# EAGLE design BLDCDriver (EAGLE 7.7.0)
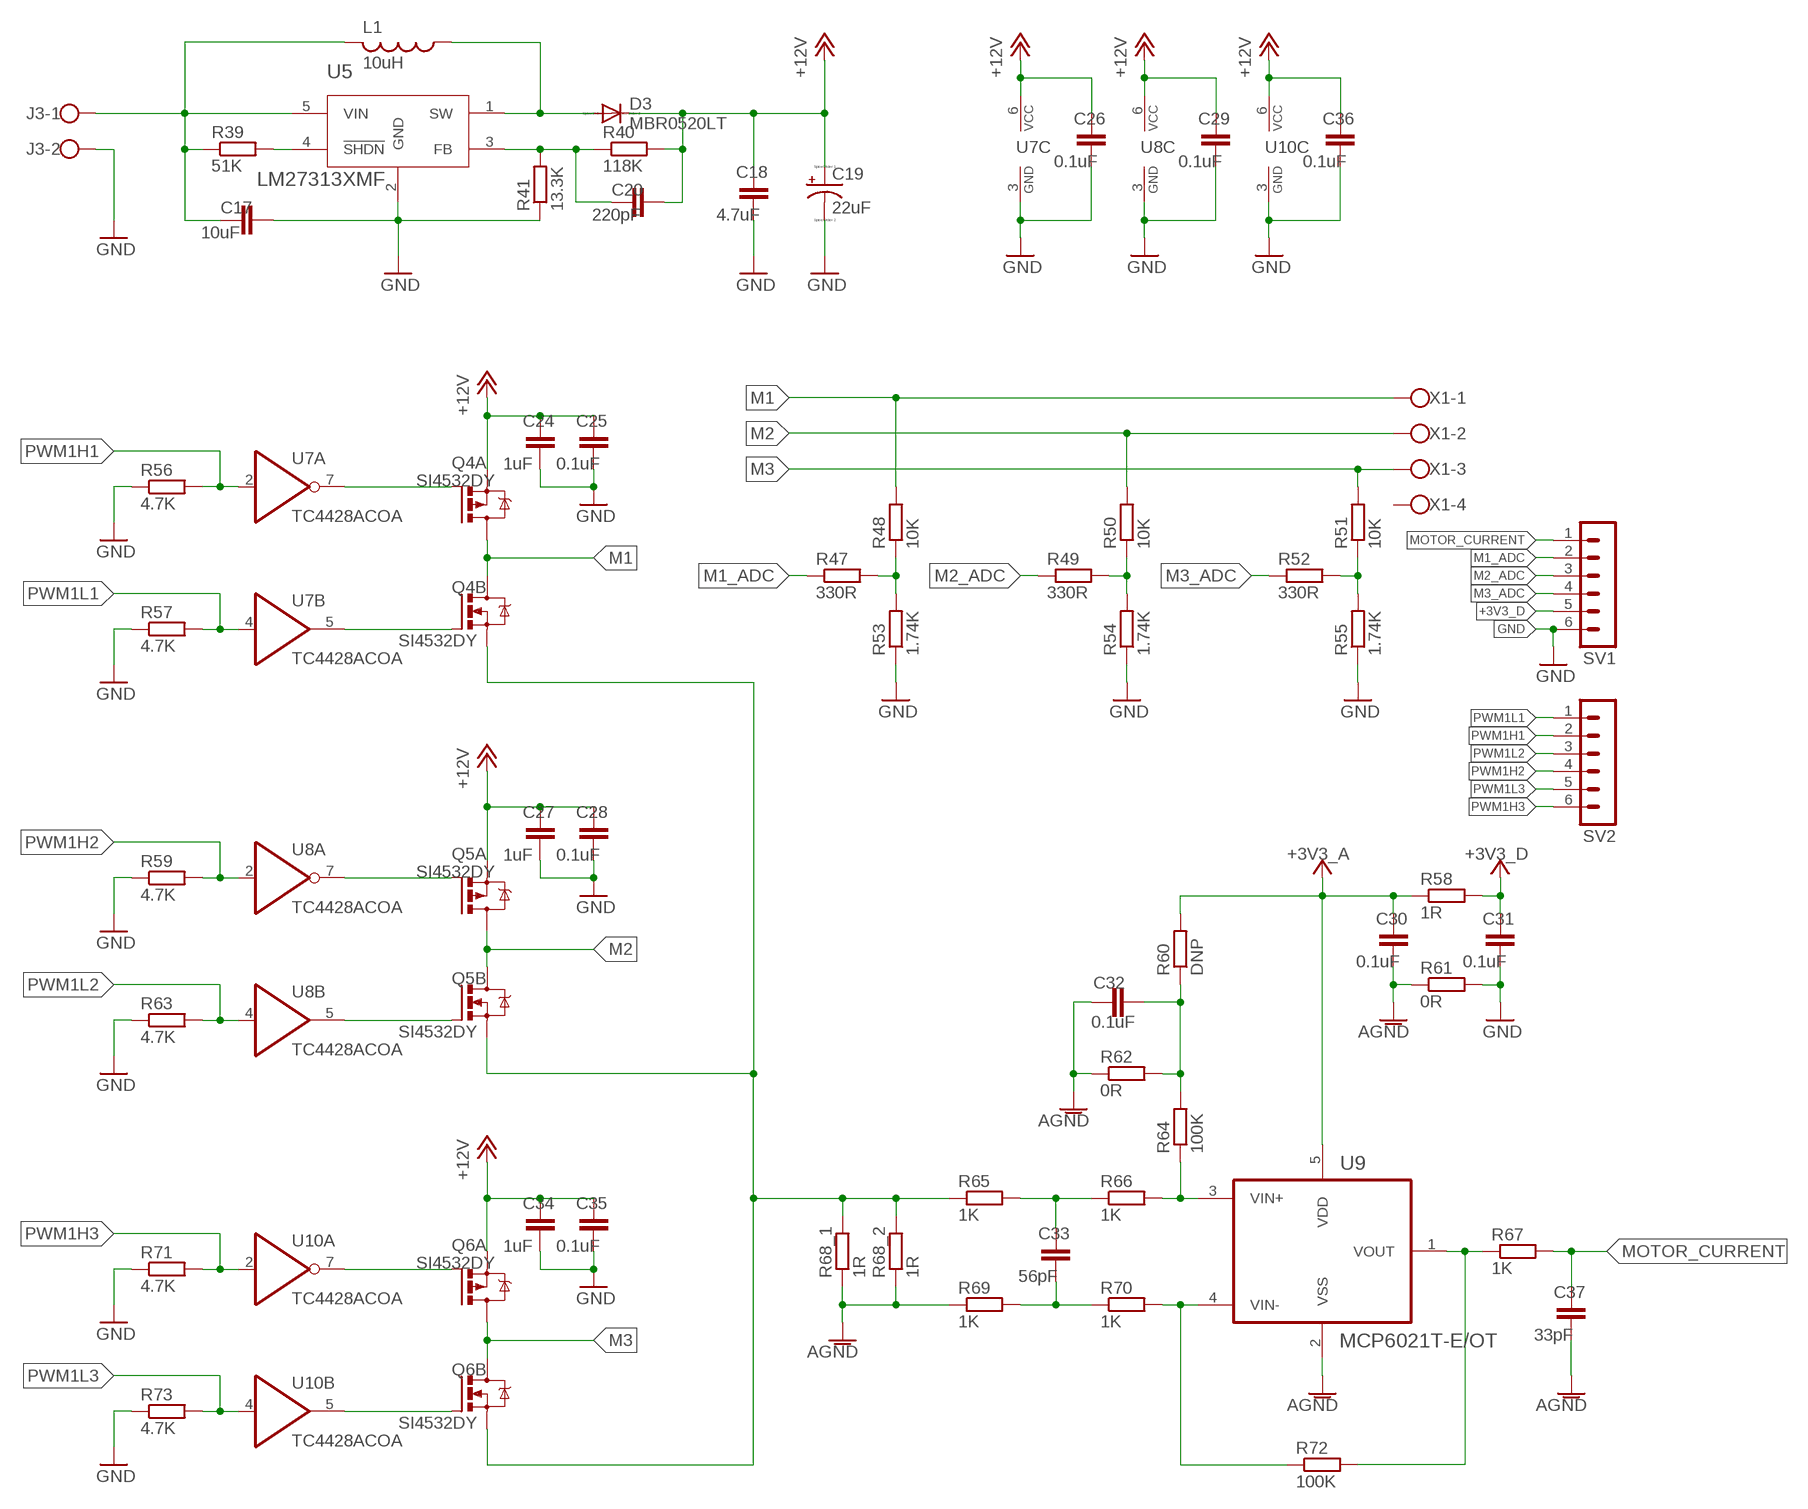
[diagram p0: schematic, sheet 1]

## Parts
C17  10uF  C-EUC0805  [C0805]
C18  4.7uF  C-EUC0805  [C0805]
C19  22uF  CPOL-USE2.5-6  [E2,5-6]
C20  220pF  C-EUC0805  [C0805]
C24  1uF  C-EUC0805  [C0805]
C25  0.1uF  C-EUC0805  [C0805]
C26  0.1uF  C-EUC0805  [C0805]
C27  1uF  C-EUC0805  [C0805]
C28  0.1uF  C-EUC0805  [C0805]
C29  0.1uF  C-EUC0805  [C0805]
C30  0.1uF  C-EUC0805  [C0805]
C31  0.1uF  C-EUC0805  [C0805]
C32  0.1uF  C-EUC0805  [C0805]
C33  56pF  C-EUC0805  [C0805]
C34  1uF  C-EUC0805  [C0805]
C35  0.1uF  C-EUC0805  [C0805]
C36  0.1uF  C-EUC0805  [C0805]
C37  33pF  C-EUC0805  [C0805]
D3  MBR0520LT  [SOD123]
J3  W237-102  [W237-102]
L1  10uH  L-USL3225M  [L3225M]
Q4  SI4532DY  [SOIC127P600X175-8N]
Q5  SI4532DY  [SOIC127P600X175-8N]
Q6  SI4532DY  [SOIC127P600X175-8N]
R39  51K  R-EU_R0805  [R0805]
R40  118K  R-EU_R0805  [R0805]
R41  13.3K  R-EU_R0805  [R0805]
R47  330R  R-EU_R0805  [R0805]
R48  10K  R-EU_R0805  [R0805]
R49  330R  R-EU_R0805  [R0805]
R50  10K  R-EU_R0805  [R0805]
R51  10K  R-EU_R0805  [R0805]
R52  330R  R-EU_R0805  [R0805]
R53  1.74K  R-EU_R0805  [R0805]
R54  1.74K  R-EU_R0805  [R0805]
R55  1.74K  R-EU_R0805  [R0805]
R56  4.7K  R-EU_R0805  [R0805]
R57  4.7K  R-EU_R0805  [R0805]
R58  1R  R-EU_R0805  [R0805]
R59  4.7K  R-EU_R0805  [R0805]
R60  DNP  R-EU_R0805  [R0805]
R61  0R  R-EU_R0805  [R0805]
R62  0R  R-EU_R0805  [R0805]
R63  4.7K  R-EU_R0805  [R0805]
R64  100K  R-EU_R0805  [R0805]
R65  1K  R-EU_R0805  [R0805]
R66  1K  R-EU_R0805  [R0805]
R67  1K  R-EU_R0805  [R0805]
R68_1  1R  R-EU_R0805  [R0805]
R68_2  1R  R-EU_R0805  [R0805]
R69  1K  R-EU_R0805  [R0805]
R70  1K  R-EU_R0805  [R0805]
R71  4.7K  R-EU_R0805  [R0805]
R72  100K  R-EU_R0805  [R0805]
R73  4.7K  R-EU_R0805  [R0805]
SV1  MA06-1  [MA06-1]
SV2  MA06-1  [MA06-1]
U5  LM27313XMF  [SOT95P285X120-5N]
U7  TC4428ACOA  [SOIC127P600X175-8N]
U8  TC4428ACOA  [SOIC127P600X175-8N]
U9  MCP6021T-E/OT  [SOT95P320X145-5N]
U10  TC4428ACOA  [SOIC127P600X175-8N]
X1  W237-4  [W237-4]

## Nets
+3V3_A: C30.1 R58.1 R60.2 U9.5(VDD) ; supply symbol labelled +3V3
+3V3_D: C31.1 R58.2 SV1.5 ; supply symbol labelled +3V3
+12V [+12V]: C18.1 C19.+ C20.2 C24.2 C25.2 C26.1 C27.2 C28.2 C29.1 C34.2 C35.2 C36.1 D3.C Q4.1(A:S) Q5.1(A:S) Q6.1(A:S) R40.2 U7.6(C:VCC) U8.6(C:VCC) U10.6(C:VCC)
AGND [agnd]: C30.2 C32.1 C37.2 R61.1 R62.1 R68_1.1 R68_2.1 R69.1 U9.2(VSS)
GND [gnd]: C17.2 C18.2 C19.- C24.1 C25.1 C26.2 C27.1 C28.1 C29.2 C31.2 C34.1 C35.1 C36.2 J3.2 R41.1 R53.1 R54.1 R55.1 R56.1 R57.1 R59.1 R61.2 R63.1 R71.1 R73.1 SV1.6 U5.2(GND) U7.3(C:GND) U8.3(C:GND) U10.3(C:GND)
M1 [motor]: Q4.5(B:D) Q4.7(A:D) R48.2 X1.1
M1_ADC: R47.1 SV1.2
M2 [motor]: Q5.5(B:D) Q5.7(A:D) R50.2 X1.2
M2_ADC: R49.1 SV1.3
M3 [motor]: Q6.5(B:D) Q6.7(A:D) R51.2 X1.3
M3_ADC: R52.1 SV1.4
MOTOR_CURRENT: C37.1 R67.2 SV1.1
N$1 [VccIn]: C17.1 J3.1 L1.2 R39.1 U5.5(VIN)
N$2: R39.2 U5.4(!SHDN!)
N$3: Q6.4(B:G) U10.5(B:O)
N$4: C20.1 R40.1 R41.2 U5.3(FB)
N$5: D3.A L1.1 U5.1(SW)
N$6: Q6.2(A:G) U10.7(A:O)
N$7: Q5.4(B:G) U8.5(B:O)
N$8: Q5.2(A:G) U8.7(A:O)
N$9: Q4.4(B:G) U7.5(B:O)
N$10: Q4.2(A:G) U7.7(A:O)
N$11: C33.2 R65.2 R66.1
N$12: C33.1 R69.2 R70.1
N$13: R64.1 R66.2 U9.3(VIN+)
N$14: Q4.3(B:S) Q5.3(B:S) Q6.3(B:S) R65.1 R68_1.2 R68_2.2
N$15: R70.2 R72.1 U9.4(VIN-)
N$16: R67.1 R72.2 U9.1(VOUT)
N$17: C32.2 R60.1 R62.2 R64.2
N$21: R51.1 R52.2 R55.2
N$22: R49.2 R50.1 R54.2
N$23: R47.2 R48.1 R53.2
PWM1H1: R56.2 SV2.2 U7.2(A:I)
PWM1H2: R59.2 SV2.4 U8.2(A:I)
PWM1H3: R71.2 SV2.6 U10.2(A:I)
PWM1L1: R57.2 SV2.1 U7.4(B:I)
PWM1L2: R63.2 SV2.3 U8.4(B:I)
PWM1L3: R73.2 SV2.5 U10.4(B:I)
Unconnected: X1.4

## Library data of the parts
C17 C18 C20 C24-C37 = resistor:C-EU: CAPACITOR, European symbol
C19 = resistor:CPOL-US: POLARIZED CAPACITOR, American symbol
D3 = diode:MBR0520LT: SCHOTTKY BARRIER RECTIFIER Source: http://onsemi.com .. MBR0520LT1-D.pdf
J3 = con-wago-500:W237-102: WAGO SCREW CLAMP; MPN: 237-102; OC_FARNELL: unknown; OC_NEWARK: 70K9898
L1 = resistor:L-US: INDUCTOR, American symbol
Q4-Q6 = SI4532DY:SI4532DY
R39-R41 R47-R67 R68_1 R68_2 R69-R73 = resistor:R-EU_: RESISTOR, European symbol
SV1 SV2 = con-lstb:MA06-1: PIN HEADER; OC_FARNELL: unknown; OC_NEWARK: unknown
U5 = LM27313XMF:LM27313XMF: BOOST CONVERTER; MPN: LM27313XMF; OC_FARNELL: 1564771; OC_NEWARK: 32M1010; PACKAGE: SOT-23-5; SUPPLIER: NationalSemiconductor
U7 U8 U10 = TC4428AEOA:TC4428ACOA: DRIVER, MOSFET, DUAL 1.5A; MPN: TC4428ACOA; OC_FARNELL: 1332312; OC_NEWARK: 34M8781; PACKAGE: SOIC-8; SUPPLIER: Microchip
U9 = MCP6021T:MCP6021T-E/OT: IC OPAMP 2.5V R-R I/O; MPN: MCP6021T-E/OT; OC_FARNELL: 1605573; OC_NEWARK: 84R5185; PACKAGE: SOT23-5; SUPPLIER: Microchip
X1 = con-wago-500:W237-4: WAGO SCREW CLAMP; OC_FARNELL: unknown; OC_NEWARK: unknown

## Net classes
0 default: drill 0.61 mm, clearance 0.205 mm
1 VccIn: width 0.61 mm, drill 0.61 mm, clearance 0.305 mm to class 0, clearance 0.305 mm
2 gnd: width 0.508 mm, drill 0.61 mm, clearance 0.305 mm to class 0, clearance 0.305 mm to class 1, clearance 0.305 mm
3 +12V: width 0.61 mm, drill 0.61 mm, clearance 0.305 mm to class 0, clearance 0.305 mm to class 1, clearance 0.305 mm to class 2, clearance 0.305 mm
4 agnd: width 0.508 mm, drill 0.61 mm, clearance 0.305 mm to class 0, clearance 0.305 mm to class 1, clearance 0.305 mm to class 2, clearance 0.305 mm to class 3, clearance 0.305 mm
5 motor: width 0.61 mm, drill 0.61 mm, clearance 0.305 mm to class 0, clearance 0.305 mm to class 1, clearance 0.305 mm to class 2, clearance 0.305 mm to class 3, clearance 0.305 mm to class 4, clearance 0.305 mm

## Board
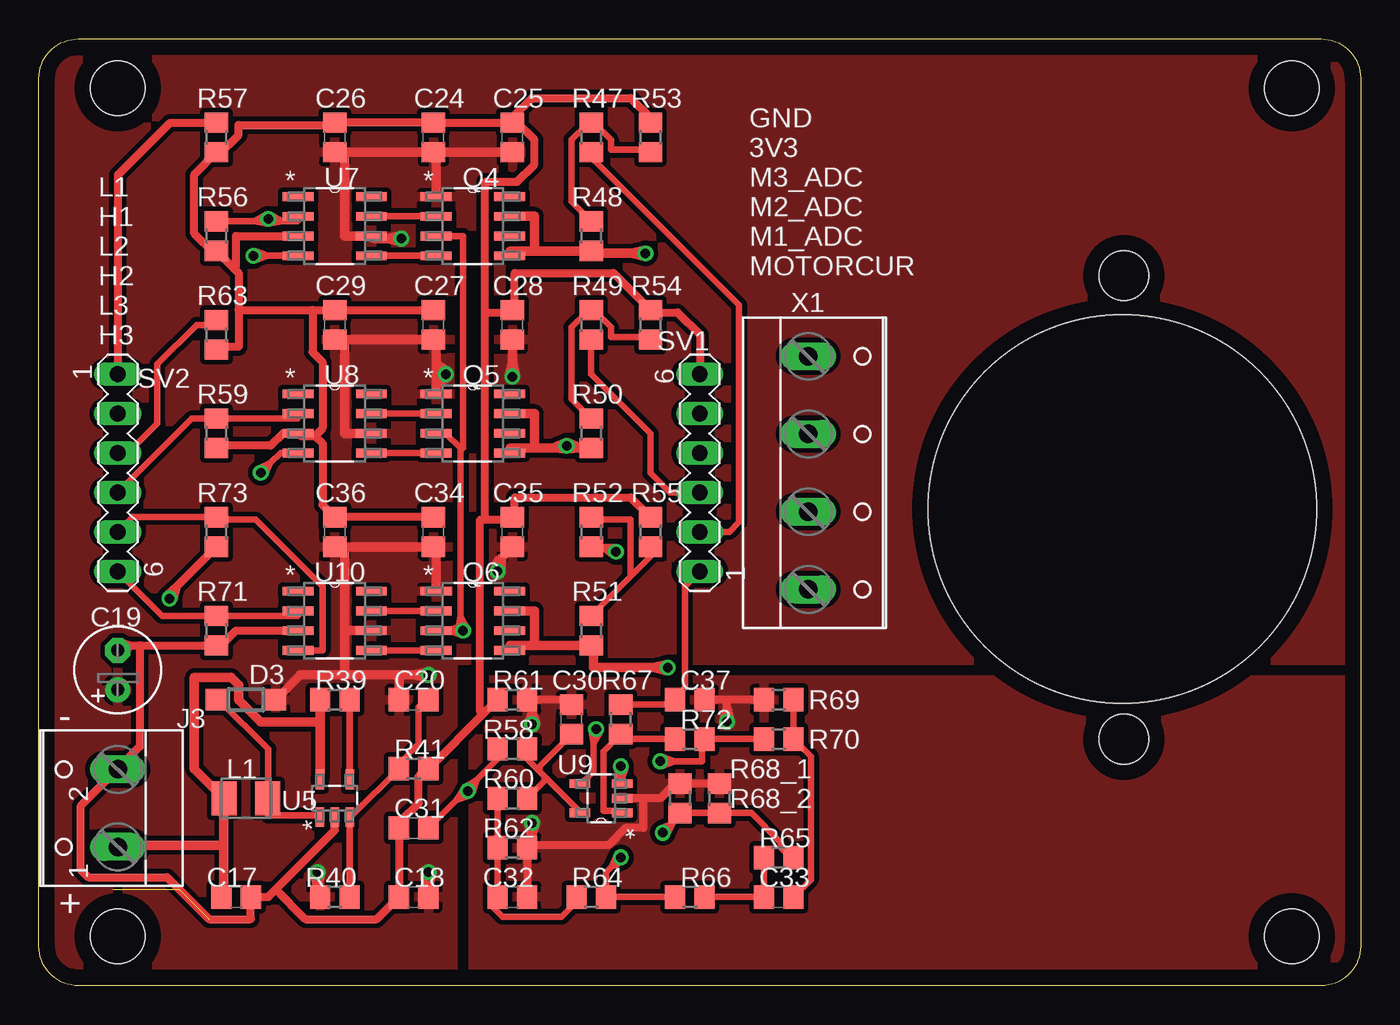
[diagram p1: board, top side]
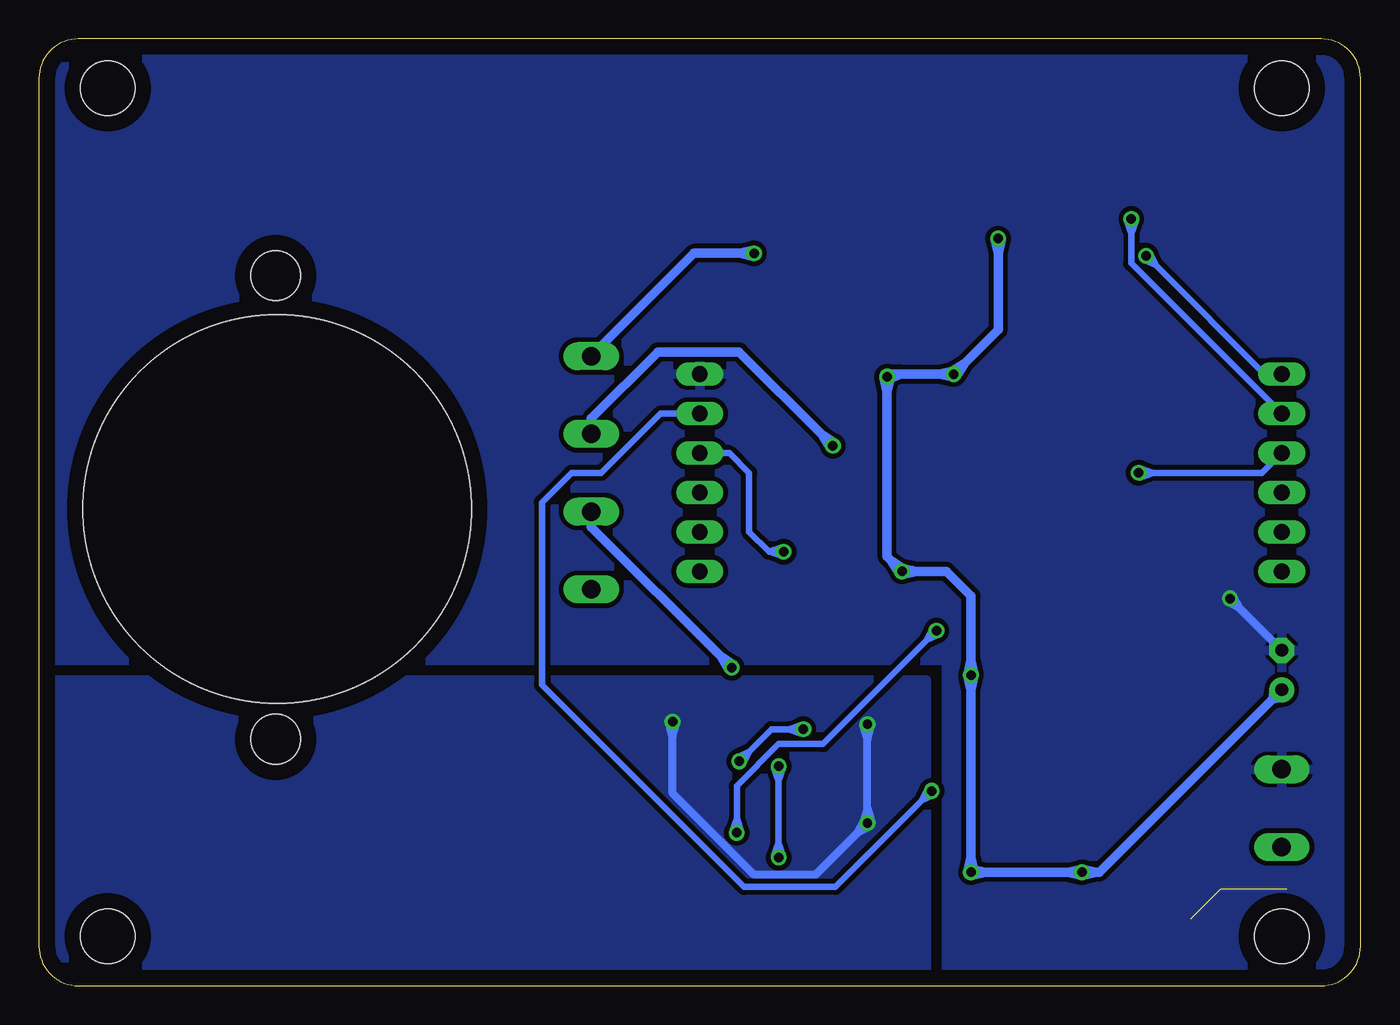
[diagram p2: board, bottom side, seen from below]

Size 85.09 x 60.96 mm. Coordinates in mm from the lower left corner, seen from the top.
Outline: 0,2.54 0,58.42 arc-90 2.54,60.96 82.55,60.96 arc-90 85.09,58.42 85.09,2.54 arc-90 82.55,0 2.54,0 arc-90 0,2.54
Copper layers (1*16): Top 0.035mm / dielectric 1.5mm / Bottom 0.035mm
Design rules "BLDCDriver": minimum track width 16mil, minimum drill 24mil, track to track 0.205mm, track to pad 0.205mm, pad to pad 0.205mm, via to via 0.205mm, smd to smd 8mil, copper to edge 40mil, drill to drill 8mil, minimum pad ring 10mil, minimum via ring 8mil, stop-mask expansion 4mil, vias tented up to drill 24mil, thermal gap 10mil
Holes 3.2 mm at 69.85,45.72 69.85,15.88
Holes 25 mm at 69.74,30.7
Holes 3.5 mm at 80.64,57.78 5.08,57.78 5.08,3.17 80.64,3.17

### Footprints (pad centres in the part's own frame; a part is rotated, then mirrored left to right if it is on the bottom)
C0805 = smd 1.3 x 1.5: 1 -0.95,0; 2 0.95,0
E2,5-6 = drill 0.813 pad 1.6: + -1.27,0 | drill 0.813 pad 1.6 octagon: - 1.27,0
SOD123 = smd 1.4 x 1.4: A 1.9,0; C -1.9,0
W237-102 = drill 1.194 long: 1 -2.5,-1.27; 2 2.5,-1.27
L3225M = smd 1.6 x 2.2: 1 -1.4,0; 2 1.4,0
SOIC127P600X175-8N = smd 1.981 x 0.559: 1 -2.362,1.905; 2 -2.362,0.635; 3 -2.362,-0.635; 4 -2.362,-1.905; 5 2.362,-1.905; 6 2.362,-0.635; 7 2.362,0.635; 8 2.362,1.905
R0805 = smd 1.3 x 1.5: 1 -0.95,0; 2 0.95,0
MA06-1 = drill 1.016 long: 1 -6.35,0; 2 -3.81,0; 3 -1.27,0; 4 1.27,0; 5 3.81,0; 6 6.35,0
SOT95P285X120-5N = smd 1.27 x 0.559: 1 -1.219,0.965; 2 -1.219,0; 3 -1.219,-0.965; 4 1.219,-0.965; 5 1.219,0.965
SOT95P320X145-5N = smd 1.321 x 0.559: 1 -1.372,0.94; 2 -1.372,0; 3 -1.372,-0.94; 4 1.372,-0.94; 5 1.372,0.94
W237-4 = drill 1.194 long: 1 -7.5,-1.27; 2 -2.5,-1.27; 3 2.5,-1.27; 4 7.5,-1.27

### Placement (x,y rotation side)
C17  12.7,5.71 0 top
C18  24.13,5.71 180 top
C19  5.08,20.32 90 top
C20  24.13,18.41 180 top
C24  25.4,54.61 270 top
C25  30.48,54.61 270 top
C26  19.05,54.61 90 top
C27  25.4,42.55 270 top
C28  30.48,42.55 270 top
C29  19.05,42.55 90 top
C30  34.29,17.14 90 top
C31  24.13,10.16 180 top
C32  30.48,5.71 180 top
C33  47.62,5.71 180 top
C34  25.4,29.21 270 top
C35  30.48,29.21 270 top
C36  19.05,29.21 90 top
C37  41.91,18.41 0 top
D3  13.34,18.41 180 top
J3  3.81,11.43 90 top
L1  13.34,12.06 180 top
Q4  27.94,48.9 0 top
Q5  27.94,36.2 0 top
Q6  27.94,23.5 0 top
R39  19.05,18.41 0 top
R40  19.05,5.71 180 top
R41  24.13,13.97 180 top
R47  35.56,54.61 90 top
R48  35.56,48.26 270 top
R49  35.56,42.55 90 top
R50  35.56,35.56 270 top
R51  35.56,22.86 270 top
R52  35.56,29.21 90 top
R53  39.37,54.61 270 top
R54  39.37,42.55 270 top
R55  39.37,29.21 270 top
R56  11.43,48.26 90 top
R57  11.43,54.61 90 top
R58  30.48,15.24 180 top
R59  11.43,35.56 90 top
R60  30.48,12.06 0 top
R61  30.48,18.41 180 top
R62  30.48,8.89 180 top
R63  11.43,41.91 90 top
R64  35.56,5.71 180 top
R65  47.62,8.26 180 top
R66  41.91,5.71 180 top
R67  37.47,17.14 90 top
R68_1  41.27,12.06 270 top
R68_2  43.81,12.06 270 top
R69  47.62,18.41 0 top
R70  47.62,15.88 180 top
R71  11.43,22.86 90 top
R72  41.91,15.88 180 top
R73  11.43,29.21 90 top
SV1  42.55,33.02 90 top
SV2  5.08,33.02 270 top
U5  19.05,12.06 90 top
U7  19.05,48.9 0 top
U8  19.05,36.2 0 top
U9  36.2,12.06 180 top
U10  19.05,23.5 0 top
X1  50.8,33.02 270 top

### Tracks (layer width: path | path; a pad name or v marks a point on that pad's centre or on a via)
+3V3_A
  Top 0.406: 32.15,13.89 31.43,14.61 R58.1 | 32.15,13.89 32.62,13.41 | 32.62,13.41 34.77,11.27 U9.5 | R60.2 32.54,13.18 32.54,13.34 32.62,13.41 | C30.1 32.23,14.13 32.23,13.97 32.15,13.89
+3V3_D  (via drill 0.61)
  Top 0.406: 28.18,13.26 29.53,14.61 R58.2 | 28.18,13.26 27.54,12.62 | 27.54,12.62 26.9,11.98 | 26.9,11.98 C31.1 | v27.62,12.54 27.54,12.62 | 28.18,13.26 | 28.18,13.26 27.46,12.8 | v27.62,12.54 27.46,12.8 | 28.18,13.26 27.91,12.45 | v27.62,12.54 27.91,12.45 | 26.9,11.98 | 26.9,11.98 27.72,12.25 | v27.62,12.54 27.72,12.25 | 26.9,11.98 27.37,12.71 | v27.62,12.54 27.37,12.71 | 28.18,13.26 27.46,12.8 | v27.62,12.54 27.46,12.8 | 28.18,13.26 27.46,12.8 | v27.62,12.54 27.46,12.8 | 28.18,13.26 27.91,12.45 | v27.62,12.54 27.91,12.45 | 26.9,11.98 27.72,12.25 | 26.9,11.98 27.37,12.71 | v27.62,12.54 27.37,12.71 | 26.9,11.98 27.72,12.25 | v27.62,12.54 27.72,12.25 | 26.9,11.98 27.37,12.71 | v27.62,12.54 27.37,12.71
  Bottom 0.406: v27.62,12.54 28.27,11.89 | 28.27,11.89 33.81,6.35 39.69,6.35 52.7,19.37 52.7,31.11 50.8,33.02 48.9,33.02 45.09,36.83 SV1.5 | 28.27,11.89 27.9,12.67 | v27.62,12.54 27.9,12.67 | 28.27,11.89 27.49,12.27 | v27.62,12.54 27.49,12.27 | 28.27,11.89 27.9,12.67 | 28.27,11.89 27.49,12.27 | 28.27,11.89 27.9,12.67 | v27.62,12.54 27.9,12.67 | 28.27,11.89 27.49,12.27 | v27.62,12.54 27.49,12.27
+12V  (via drill 0.61)
  Top 0.61: Q6.1 25.56,25.4 25.56,28.1 C34.2 C36.1 19.68,28.1 19.68,22.86 | 23.18,20 19.68,20 | 19.68,20 16.83,20 D3.C | 23.18,20 C20.2 | 19.68,22.86 U10.6 | 19.68,20 19.68,22.86 | C24.2 C26.1 19.68,53.5 19.68,48.26 U7.6 21.59,48.1 22.42,48.1 | C25.2 25.56,53.66 C24.2 | Q4.1 25.56,50.8 25.56,53.5 C24.2 | U8.6 19.68,35.56 19.68,41.43 C29.1 C27.2 25.56,41.43 25.56,40.03 | 25.56,40.03 25.56,39.37 | 25.56,39.37 25.56,38.71 | 25.56,38.71 25.56,38.1 Q5.1 | v17.94,7.3 17.94,6.39 | 17.94,6.39 17.94,5.87 R40.2 | C18.1 24.92,5.71 25.08,5.87 25.08,6.39 | 29.77,27.55 29.53,27.3 v29.53,26.67 | 29.77,27.55 C35.2 | v30.48,39.21 30.48,40.13 | 30.48,40.13 C28.2 | v26.19,39.37 25.56,39.37 | v23.34,48.1 22.42,48.1 | v25.08,20 24.17,20 | 24.17,20 23.18,20 | 25.08,6.39 v25.08,7.3 | 17.94,6.39 18.14,7.26 | v17.94,7.3 18.14,7.26 | 17.94,6.39 17.74,7.26 | v17.94,7.3 17.74,7.26 | 17.94,6.39 18.14,7.26 | 17.94,6.39 17.74,7.26 | 17.94,6.39 18.14,7.26 | v17.94,7.3 18.14,7.26 | 17.94,6.39 17.74,7.26 | v17.94,7.3 17.74,7.26 | 25.08,6.39 25.28,7.26 | v25.08,7.3 25.28,7.26 | 25.08,6.39 24.88,7.26 | v25.08,7.3 24.88,7.26 | 25.08,6.39 25.28,7.26 | 25.08,6.39 24.88,7.26 | 25.08,6.39 25.28,7.26 | v25.08,7.3 25.28,7.26 | 25.08,6.39 24.88,7.26 | v25.08,7.3 24.88,7.26 | 29.77,27.55 29.35,26.77 v29.53,26.67 | 29.77,27.55 29.73,26.66 v29.53,26.67 | 30.48,40.13 30.28,39.26 | v30.48,39.21 30.28,39.26 | 30.48,40.13 30.68,39.26 | v30.48,39.21 30.68,39.26 | 30.48,40.13 30.28,39.26 | 30.48,40.13 30.68,39.26 | 30.48,40.13 30.28,39.26 | v30.48,39.21 30.28,39.26 | 30.48,40.13 30.68,39.26 | v30.48,39.21 30.68,39.26 | 25.56,40.03 26.02,39.27 v26.19,39.37 | 25.56,40.03 26.3,39.54 v26.19,39.37 | 25.56,38.71 26.3,39.2 v26.19,39.37
  Top 0.61: 25.56,38.71 26.02,39.48 v26.19,39.37 | 22.42,48.1 23.29,47.9 | v23.34,48.1 23.29,47.9 | 22.42,48.1 23.29,48.3 | v23.34,48.1 23.29,48.3 | 22.42,48.1 23.29,47.9 | 22.42,48.1 23.29,48.3 | 22.42,48.1 23.29,47.9 | v23.34,48.1 23.29,47.9 | 22.42,48.1 23.29,48.3 | v23.34,48.1 23.29,48.3 | 24.17,20 25.04,19.8 | v25.08,20 25.04,19.8 | 24.17,20 25.04,20.2 | v25.08,20 25.04,20.2 | 25.04,19.8 24.17,20 25.04,20.2 | 24.17,20 25.04,19.8 | v25.08,20 25.04,19.8 | 24.17,20 25.04,20.2 | v25.08,20 25.04,20.2
  Bottom 0.61: 17.02,7.3 16.83,7.3 5.66,18.48 | 17.02,7.3 v17.94,7.3 | C19.+ 5.66,18.48 | v17.94,7.3 18.85,7.3 | 18.85,7.3 24.17,7.3 | 24.17,7.3 v25.08,7.3 | v25.08,7.3 25.24,7.46 25.08,7.62 25.08,8.22 | 30.48,38.3 30.48,27.62 30.17,27.32 | 30.48,38.3 v30.48,39.21 | v29.53,26.67 30.17,27.32 | 29.58,39.37 30.32,39.37 v30.48,39.21 | 29.58,39.37 27.11,39.37 | 27.11,39.37 v26.19,39.37 | 23.34,47.19 23.34,42.23 25.55,40.02 | 23.34,47.19 v23.34,48.1 | v26.19,39.37 25.55,40.02 | 25.08,8.22 25.08,19.09 | 25.08,19.09 v25.08,20 | v25.08,20 25.08,20.92 | 25.08,20.92 25.08,25.08 26.67,26.67 28.61,26.67 | 28.61,26.67 v29.53,26.67 | 17.02,7.3 17.89,7.1 | v17.94,7.3 17.89,7.1 | 17.02,7.3 17.89,7.5 | v17.94,7.3 17.89,7.5 | 18.85,7.3 17.98,7.5 | v17.94,7.3 17.98,7.5 | 18.85,7.3 17.98,7.1 | v17.94,7.3 17.98,7.1 | 17.89,7.1 17.02,7.3 17.89,7.5 | 17.02,7.3 17.89,7.1 | v17.94,7.3 17.89,7.1 | 17.02,7.3 17.89,7.5 | v17.94,7.3 17.89,7.5 | 18.85,7.3 17.98,7.5 | 18.85,7.3 17.98,7.1 | 17.98,7.5 18.85,7.3 17.98,7.1 | v17.94,7.3 17.98,7.5 | v17.94,7.3 17.98,7.1 | 24.17,7.3 25.04,7.1 | v25.08,7.3 25.04,7.1 | 24.17,7.3 25.04,7.5 | v25.08,7.3 25.04,7.5 | 25.08,8.22 24.88,7.35 | v25.08,7.3 24.88,7.35 | 25.08,8.22 25.28,7.35 | v25.08,7.3 25.28,7.35 | 25.04,7.1 24.17,7.3 25.04,7.5 | 24.17,7.3 25.04,7.1 | v25.08,7.3 25.04,7.1 | 24.17,7.3 25.04,7.5 | v25.08,7.3 25.04,7.5 | 25.08,8.22 24.88,7.35 | 25.08,8.22 25.28,7.35 | 25.08,8.22 24.88,7.35 | v25.08,7.3 24.88,7.35 | 25.08,8.22 25.28,7.35 | v25.08,7.3 25.28,7.35 | 30.17,27.32 29.42,26.84 | v29.53,26.67 29.42,26.84 | 30.17,27.32 29.7,26.56 | v29.53,26.67 29.7,26.56 | 28.61,26.67 29.48,26.47 | v29.53,26.67 29.48,26.47 | 28.61,26.67 29.48,26.87 | v29.53,26.67 29.48,26.87 | 30.17,27.32 29.42,26.84
  Bottom 0.61: v29.53,26.67 29.42,26.84 | 30.17,27.32 29.7,26.56 | v29.53,26.67 29.7,26.56 | 28.61,26.67 29.48,26.47 | 28.61,26.67 29.48,26.87 | 28.61,26.67 29.48,26.47 | v29.53,26.67 29.48,26.47 | 28.61,26.67 29.48,26.87 | v29.53,26.67 29.48,26.87 | 30.48,38.3 30.68,39.17 | v30.48,39.21 30.68,39.17 | 30.48,38.3 30.28,39.17 | v30.48,39.21 30.28,39.17 | 30.48,38.3 30.68,39.17 | 30.48,38.3 30.28,39.17 | 30.48,38.3 30.68,39.17 | v30.48,39.21 30.68,39.17 | 30.48,38.3 30.28,39.17 | v30.48,39.21 30.28,39.17 | 29.58,39.37 30.4,39.02 v30.48,39.21 | 29.58,39.37 30.47,39.41 v30.48,39.21 | 27.11,39.37 26.24,39.57 | v26.19,39.37 26.24,39.57 | 27.11,39.37 26.24,39.17 | v26.19,39.37 26.24,39.17 | 25.55,40.02 26.02,39.26 | v26.19,39.37 26.02,39.26 | 25.55,40.02 26.3,39.54 | v26.19,39.37 26.3,39.54 | 27.11,39.37 26.24,39.57 | 27.11,39.37 26.24,39.17 | 27.11,39.37 26.24,39.57 | v26.19,39.37 26.24,39.57 | 27.11,39.37 26.24,39.17 | v26.19,39.37 26.24,39.17 | 25.55,40.02 26.02,39.26 | 25.55,40.02 26.3,39.54 | 25.55,40.02 26.02,39.26 | v26.19,39.37 26.02,39.26 | 25.55,40.02 26.3,39.54 | v26.19,39.37 26.3,39.54 | 23.34,47.19 23.53,48.06 | v23.34,48.1 23.53,48.06 | 23.34,47.19 23.14,48.06 | v23.34,48.1 23.14,48.06 | 23.34,47.19 23.53,48.06 | 23.34,47.19 23.14,48.06 | 23.34,47.19 23.53,48.06 | v23.34,48.1 23.53,48.06 | 23.34,47.19 23.14,48.06 | v23.34,48.1 23.14,48.06 | 25.08,19.09 25.28,19.96 | v25.08,20 25.28,19.96 | 25.08,19.09 24.88,19.96 | v25.08,20 24.88,19.96 | 25.08,20.92 24.88,20.05 | v25.08,20 24.88,20.05 | 25.08,20.92 25.28,20.05 | v25.08,20 25.28,20.05 | 25.08,19.09 25.28,19.96 | 25.08,19.09 24.88,19.96 | 25.08,19.09 25.28,19.96 | v25.08,20 25.28,19.96 | 25.08,19.09 24.88,19.96 | v25.08,20 24.88,19.96
  Bottom 0.61: 25.08,20.92 24.88,20.05 | 25.08,20.92 25.28,20.05 | 25.08,20.92 24.88,20.05 | v25.08,20 24.88,20.05 | 25.08,20.92 25.28,20.05 | v25.08,20 25.28,20.05 | 5.66,18.48 5.57,19.11 C19.+ | 5.66,18.48 5.02,18.56 C19.+
  pour Top: 26.67,0 26.67,20.95 85.09,20.95 85.09,60.96 0,60.96 0,0
AGND  (via drill 0.61)
  Top 0.508: R69.1 44.29,18.41 | 44.29,18.41 C37.2 | C30.2 34.29,18.41 R61.1 31.75,18.26 31.75,17.74 | C32.1 R62.1 | 38.89,12.06 40.01,12.06 40.8,12.86 41.27,12.86 R68_1.1 41.43,13.02 R68_2.1 | 38.89,12.06 U9.2 | 38.89,12.06 38.89,10.16 37.78,10.16 36.67,9.05 31.59,9.05 R62.1 | v31.75,16.83 31.75,17.74 | 31.75,9.56 31.75,9.21 R62.1 | 31.75,9.56 v31.75,10.48 | v44.29,16.99 44.29,17.9 | 44.29,17.9 44.29,18.41 | 31.75,17.74 31.51,16.9 | v31.75,16.83 31.51,16.9 | 31.75,17.74 31.99,16.9 | v31.75,16.83 31.99,16.9 | 31.75,17.74 31.51,16.9 | 31.75,17.74 31.99,16.9 | 31.75,17.74 31.51,16.9 | v31.75,16.83 31.51,16.9 | 31.75,17.74 31.99,16.9 | v31.75,16.83 31.99,16.9 | 31.75,9.56 31.99,10.41 | v31.75,10.48 31.99,10.41 | 31.75,9.56 31.51,10.41 | v31.75,10.48 31.51,10.41 | 31.75,9.56 31.99,10.41 | 31.75,9.56 31.51,10.41 | 31.75,9.56 31.99,10.41 | v31.75,10.48 31.99,10.41 | 31.75,9.56 31.51,10.41 | v31.75,10.48 31.51,10.41 | 44.29,17.9 44.05,17.06 | v44.29,16.99 44.05,17.06 | 44.29,17.9 44.53,17.06 | v44.29,16.99 44.53,17.06 | 44.29,17.9 44.05,17.06 | 44.29,17.9 44.53,17.06 | 44.29,17.9 44.05,17.06 | v44.29,16.99 44.05,17.06 | 44.29,17.9 44.53,17.06 | v44.29,16.99 44.53,17.06
  Bottom 0.508: v31.75,10.48 31.75,11.39 | 31.75,11.39 31.75,15.91 | 31.75,15.91 v31.75,16.83 | 44.29,16.07 44.29,12.38 39.05,7.14 35.08,7.14 32.4,9.83 | 44.29,16.07 v44.29,16.99 | v31.75,10.48 32.4,9.83 | 31.75,15.91 31.99,16.76 | v31.75,16.83 31.99,16.76 | 31.75,15.91 31.51,16.76 | v31.75,16.83 31.51,16.76 | 31.75,15.91 31.99,16.76 | 31.75,15.91 31.51,16.76 | 31.75,15.91 31.99,16.76 | v31.75,16.83 31.99,16.76 | 31.75,15.91 31.51,16.76 | v31.75,16.83 31.51,16.76 | 31.75,11.39 31.51,10.55 | v31.75,10.48 31.51,10.55 | 31.75,11.39 31.99,10.55 | v31.75,10.48 31.99,10.55 | 32.4,9.83 31.97,10.6 | v31.75,10.48 31.97,10.6 | 32.4,9.83 31.63,10.26 | v31.75,10.48 31.63,10.26 | 31.75,11.39 31.51,10.55 | 31.75,11.39 31.99,10.55 | 31.75,11.39 31.51,10.55 | v31.75,10.48 31.51,10.55 | 31.75,11.39 31.99,10.55 | v31.75,10.48 31.99,10.55 | 32.4,9.83 31.97,10.6 | 32.4,9.83 31.63,10.26 | 32.4,9.83 31.97,10.6 | v31.75,10.48 31.97,10.6 | 32.4,9.83 31.63,10.26 | v31.75,10.48 31.63,10.26 | 44.29,16.07 44.53,16.92 | v44.29,16.99 44.53,16.92 | 44.29,16.07 44.05,16.92 | v44.29,16.99 44.05,16.92 | 44.29,16.07 44.53,16.92 | 44.29,16.07 44.05,16.92 | 44.29,16.07 44.53,16.92 | v44.29,16.99 44.53,16.92 | 44.29,16.07 44.05,16.92 | v44.29,16.99 44.05,16.92
  pour Bottom: 27.94,0 27.94,19.68 85.09,19.68 85.09,0
  pour Top: 27.94,19.68 85.09,19.68 85.09,0 27.94,0
GND  (via drill 0.61)  (2 unrouted)
  Top 0.508: C25.1 25.56,55.56 C24.1 C26.2 18.89,55.4 12.86,55.4 12.86,54.77 11.59,53.5 R57.1 10,52.23 10,48.42 11.27,47.15 R56.1 12.54,46.2 | R53.1 | C25.1 30.64,55.72 30.64,56.04 31.75,57.15 38.1,57.15 39.37,55.88 | C34.1 C36.2 18.89,30.32 18.26,30.96 18.26,34.92 17.78,35.4 | R59.1 11.43,34.77 14.92,34.77 15.72,35.56 U8.3 16.83,35.4 17.78,35.4 | 12.86,43.5 12.86,45.88 12.54,46.2 | 12.86,43.5 12.86,41.12 11.43,41.12 R63.1 | 12.86,43.5 17.62,43.5 | 17.62,43.5 C29.2 19.21,43.5 C27.1 | U7.3 12.7,48.26 12.7,46.35 12.54,46.2 | 17.78,35.4 18.26,35.88 18.26,40.16 17.62,40.8 17.62,43.5 | 5.83,21.91 5.08,21.91 C19.- | 5.83,21.91 6.51,21.91 | 6.51,21.91 R71.1 11.59,21.75 12.7,22.86 U10.3 | 8.88,25.71 8.41,25.24 v8.41,24.92 | 8.88,25.71 R73.1 | 6.51,21.91 6.51,15.4 5.08,13.97 J3.2 4.92,13.81 2.7,11.59 2.7,7.46 3.17,6.99 8.26,6.99 10.95,4.29 13.65,4.29 C17.2 | U5.2 19.05,10 15.24,6.19 | 15.24,6.19 14.76,5.71 C17.2 | C18.2 C31.2 23.34,10.32 23.34,10.64 24.45,11.75 24.45,13.49 24.92,13.97 R41.1 25.24,14.13 28.57,17.46 | 28.57,17.46 R61.2 | 28.73,30 28.42,30 28.42,17.62 28.57,17.46 | 28.73,30 30.48,30 C35.1 30.64,30.32 30.64,31.43 38.1,31.43 R55.1 | 28.73,43.34 30.48,43.34 C28.1 30.64,43.66 30.64,45.88 36.99,45.88 39.21,43.66 R54.1 39.37,43.34 41.12,43.34 42.55,41.91 SV1.6 | 28.73,30 28.73,43.34 | 15.24,6.19 17.14,4.29 21.75,4.29 C18.2 | 23.02,5.56 C18.2 | 13.49,5.56 C17.2 | 28.73,43.34 28.73,51.75 30.8,51.75 31.91,52.86 31.91,54.45 30.8,55.56 C25.1 | 8.88,25.71 8.24,25.11 v8.41,24.92 | 8.88,25.71 8.66,24.86 v8.41,24.92 | 5.83,21.91 5.26,22.11 C19.- | 5.83,21.91 5.58,21.36 C19.-
  Top 0.61: 39.37,55.88 R53.1
  Bottom 0.508: C19.- 5.66,22.16 | 5.66,22.16 7.77,24.28 | 7.77,24.28 v8.41,24.92 | 7.77,24.28 | 7.77,24.28 8.54,24.7 | v8.41,24.92 8.54,24.7 | 7.77,24.28 | 7.77,24.28 8.19,25.05 | v8.41,24.92 8.19,25.05 | 7.77,24.28 8.54,24.7 | 7.77,24.28 8.19,25.05 | 7.77,24.28 8.54,24.7 | v8.41,24.92 8.54,24.7 | 7.77,24.28 8.19,25.05 | v8.41,24.92 8.19,25.05 | 5.66,22.16 5.05,22.14 C19.- | 5.66,22.16 5.62,21.56 C19.-
  pour Bottom: 26.67,0 0,0 0,60.96 85.09,60.96 85.09,20.95 26.67,20.95
M1  (via drill 0.61)
  Top 0.61: 31.91,47.31 30.32,47.31 30.32,46.99 Q4.5 | 31.91,47.31 R48.2 35.72,47.15 38.14,47.15 | Q4.7 31.91,49.53 31.91,47.31 | 38.14,47.15 v39.05,47.15 | 38.14,47.15 39.01,46.95 | v39.05,47.15 39.01,46.95 | 38.14,47.15 39.01,47.35 | v39.05,47.15 39.01,47.35 | 38.14,47.15 39.01,46.95 | 38.14,47.15 39.01,47.35 | 38.14,47.15 39.01,46.95 | v39.05,47.15 39.01,46.95 | 38.14,47.15 39.01,47.35 | v39.05,47.15 39.01,47.35
  Bottom 0.61: v39.05,47.15 39.97,47.15 | 39.97,47.15 42.9,47.15 X1.1 | 39.97,47.15 39.1,47.35 | v39.05,47.15 39.1,47.35 | 39.97,47.15 39.1,46.95 | v39.05,47.15 39.1,46.95 | 39.97,47.15 39.1,47.35 | 39.97,47.15 39.1,46.95 | 39.97,47.15 39.1,47.35 | v39.05,47.15 39.1,47.35 | 39.97,47.15 39.1,46.95 | v39.05,47.15 39.1,46.95
M1_ADC
  Top 0.406: R47.1 35.56,53.34 45.09,43.81 45.09,29.84 44.45,29.21 SV1.2
M2  (via drill 0.61)
  Top 0.61: 31.91,34.61 30.32,34.61 30.32,34.29 Q5.5 | 31.91,34.61 33.07,34.61 | 33.07,34.61 33.97,34.61 | 33.97,34.61 34.87,34.61 | 34.87,34.61 R50.2 | Q5.7 31.91,36.83 31.91,34.61 | v33.97,34.77 33.97,34.61 | 33.07,34.61 33.96,34.56 v33.97,34.77 | 33.07,34.61 33.89,34.95 v33.97,34.77 | 34.87,34.61 34.05,34.95 v33.97,34.77 | 34.87,34.61 33.98,34.56 v33.97,34.77
  Bottom 0.61: v33.97,34.77 34.62,35.41 | 34.62,35.41 40.01,40.8 45.24,40.8 49.53,36.51 X1.2 | 34.62,35.41 33.86,34.94 | v33.97,34.77 33.86,34.94 | 34.62,35.41 34.15,34.66 | v33.97,34.77 34.15,34.66 | 34.62,35.41 33.86,34.94 | v33.97,34.77 33.86,34.94 | 34.62,35.41 34.15,34.66 | v33.97,34.77 34.15,34.66
M2_ADC
  Top 0.406: R49.1 35.56,39.37 39.37,35.56 39.37,33.02 40.64,31.75 SV1.3
M3  (via drill 0.61)
  Top 0.61: 31.91,21.91 30.32,21.91 30.32,21.59 Q6.5 | 31.91,21.91 R51.2 35.72,21.75 35.72,20.48 39.57,20.48 | Q6.7 31.91,24.13 31.91,21.91 | 39.57,20.48 v40.48,20.48 | 39.57,20.48 40.44,20.28 | v40.48,20.48 40.44,20.28 | 39.57,20.48 40.44,20.68 | v40.48,20.48 40.44,20.68 | 39.57,20.48 40.44,20.28 | 39.57,20.48 40.44,20.68 | 39.57,20.48 40.44,20.28 | v40.48,20.48 40.44,20.28 | 39.57,20.48 40.44,20.68 | v40.48,20.48 40.44,20.68
  Bottom 0.61: v40.48,20.48 41.13,21.12 | 41.13,21.12 49.53,29.53 X1.3 | 41.13,21.12 40.37,20.65 | v40.48,20.48 40.37,20.65 | 41.13,21.12 40.65,20.37 | v40.48,20.48 40.65,20.37 | 41.13,21.12 40.37,20.65 | v40.48,20.48 40.37,20.65 | 41.13,21.12 40.65,20.37 | v40.48,20.48 40.65,20.37
M3_ADC  (via drill 0.61)
  Top 0.406: 36.29,28.26 37.15,28.26 v37.15,27.94 | 36.29,28.26 R52.1 | 36.29,28.26 36.95,27.71 v37.15,27.94 | 36.29,28.26 37.15,28.25 v37.15,27.94
  Bottom 0.406: v37.15,27.94 38.06,27.94 | 38.06,27.94 38.1,27.94 39.37,29.21 39.37,33.02 40.64,34.29 SV1.4 | 38.06,27.94 37.25,28.23 | v37.15,27.94 37.25,28.23 | 38.06,27.94 37.25,27.65 | v37.15,27.94 37.25,27.65 | 38.06,27.94 37.25,28.23 | 37.25,28.23 | v37.15,27.94 37.25,28.23 | 38.06,27.94 37.25,27.65 | v37.15,27.94 37.25,27.65 | 38.06,27.94 37.25,28.23 | v37.15,27.94 37.25,28.23 | 38.06,27.94 37.25,27.65 | v37.15,27.94 37.25,27.65
MOTOR_CURRENT
  Top 0.406: R67.2 40.96,18.1 C37.1 40.96,18.57 41.59,19.21 41.59,25.72 SV1.1
N$1
  Top 0.61: 18.1,16.99 R39.1 | 18.1,16.99 18.1,13.34 U5.5 | 11.91,9.05 11.91,12.06 L1.2 11.75,12.22 10,13.97 10,19.84 12.38,19.84 12.86,19.37 12.86,18.41 14.29,16.99 18.1,16.99 | 11.91,9.05 11.91,5.71 C17.1 | 11.91,9.05 5.08,9.05 J3.1
N$2
  Top 0.406: U5.4 20,13.34 R39.2
N$3
  Top 0.406: Q6.4 U10.5
N$4
  Top 0.406: R40.1 20,10.79 U5.3 20.16,10.95 R41.2 23.18,14.13 23.18,14.29 24.45,15.56 24.45,17.94 24.92,18.41 C20.1
N$5
  Top 0.406: U5.1 17.94,10.95 14.76,10.95 14.76,12.06 L1.1 14.76,12.22 14.76,15.24 11.59,18.41 D3.A
N$6
  Top 0.406: Q6.2 U10.7
N$7
  Top 0.406: Q5.4 U8.5
N$8
  Top 0.406: Q5.2 U8.7
N$9
  Top 0.406: Q4.4 U7.5
N$10
  Top 0.406: Q4.2 U7.7
N$11
  Top 0.406: R66.1 C33.2 46.67,5.87 R65.2
N$12
  Top 0.406: C33.1 49.69,6.83 49.69,14.76 R70.1 48.58,16.03 R69.2
N$13  (via drill 0.61)
  Top 0.406: v37.47,14.13 37.47,13.21 | 37.47,13.21 37.47,13.02 U9.3 | 36.82,7.61 36.51,7.3 R64.1 R66.2 | 36.82,7.61 v37.47,8.26 | 37.47,13.21 37.75,14.03 | 37.75,14.03 | v37.47,14.13 37.75,14.03 | 37.47,13.21 37.18,14.03 | v37.47,14.13 37.18,14.03 | 37.47,13.21 37.75,14.03 | v37.47,14.13 37.75,14.03 | 37.47,13.21 37.18,14.03 | v37.47,14.13 37.18,14.03 | 36.82,7.61 | 36.82,7.61 37.6,7.98 | v37.47,8.26 37.6,7.98 | 36.82,7.61 | 36.82,7.61 37.19,8.39 | v37.47,8.26 37.19,8.39 | 36.82,7.61 37.6,7.98 | 36.82,7.61 37.19,8.39 | 36.82,7.61 37.6,7.98 | v37.47,8.26 37.6,7.98 | 36.82,7.61 37.19,8.39 | v37.47,8.26 37.19,8.39
  Bottom 0.406: v37.47,8.26 37.47,9.17 | 37.47,9.17 37.47,13.21 | 37.47,13.21 v37.47,14.13 | 37.47,13.21 37.75,14.03 | 37.75,14.03 | v37.47,14.13 37.75,14.03 | 37.47,13.21 37.18,14.03 | v37.47,14.13 37.18,14.03 | 37.47,13.21 37.75,14.03 | v37.47,14.13 37.75,14.03 | 37.47,13.21 37.18,14.03 | v37.47,14.13 37.18,14.03 | 37.47,9.17 37.18,8.36 | v37.47,8.26 37.18,8.36 | 37.47,9.17 37.75,8.36 | v37.47,8.26 37.75,8.36 | 37.47,9.17 37.18,8.36 | 37.18,8.36 | v37.47,8.26 37.18,8.36 | 37.47,9.17 37.75,8.36 | v37.47,8.26 37.75,8.36 | 37.47,9.17 37.18,8.36 | v37.47,8.26 37.18,8.36 | 37.47,9.17 37.75,8.36 | v37.47,8.26 37.75,8.36
N$14  (via drill 0.61)
  Top 0.406: R65.1 48.42,8.26 47.78,8.89 47.78,9.21 45.88,11.11 43.97,11.11 R68_2.2 R68_1.2 41.27,10.95 40.81,10.49 | 27.15,22.86 26.39,22.86 | 26.39,22.86 Q6.3 | 27.15,34.61 27.15,23.76 | 27.15,23.76 27.15,22.86 | 27.15,34.61 26.19,35.56 Q5.3 | Q4.3 27.3,48.26 27.3,34.61 27.15,34.61 | v40.16,9.84 40.81,10.49 | v27.3,22.86 27.15,22.86 | 40.81,10.49 40.03,10.12 | v40.16,9.84 40.03,10.12 | 40.81,10.49 40.44,9.71 | v40.16,9.84 40.44,9.71 | 40.81,10.49 40.03,10.12 | v40.16,9.84 40.03,10.12 | 40.81,10.49 40.44,9.71 | v40.16,9.84 40.44,9.71 | 26.39,22.86 27.2,23.15 | 26.39,22.86 27.2,22.57 | 27.2,22.57 | v27.3,22.86 27.2,22.57 | 26.39,22.86 27.2,23.15 | v27.3,22.86 27.2,23.15 | 26.39,22.86 27.2,22.57 | v27.3,22.86 27.2,22.57 | 26.39,22.86 27.2,23.15 | v27.3,22.86 27.2,23.15 | 27.15,23.76 27,22.91 v27.3,22.86 | 27.15,23.76 27.57,23.01 v27.3,22.86
  Bottom 0.406: 40.16,10.76 40.16,12.86 37.47,15.56 34.61,15.56 27.95,22.21 | 40.16,10.76 v40.16,9.84 | v27.3,22.86 27.95,22.21 | 40.16,10.76 39.88,9.94 | v40.16,9.84 39.88,9.94 | 40.16,10.76 40.45,9.94 | v40.16,9.84 40.45,9.94 | 40.16,10.76 39.88,9.94 | 39.88,9.94 | v40.16,9.84 39.88,9.94 | 40.16,10.76 40.45,9.94 | v40.16,9.84 40.45,9.94 | 40.16,10.76 39.88,9.94 | v40.16,9.84 39.88,9.94 | 40.16,10.76 40.45,9.94 | v40.16,9.84 40.45,9.94 | 27.95,22.21 27.58,22.99 | v27.3,22.86 27.58,22.99 | 27.95,22.21 27.17,22.59 | v27.3,22.86 27.17,22.59 | 27.95,22.21 27.58,22.99 | 27.95,22.21 27.17,22.59 | 27.95,22.21 27.58,22.99 | v27.3,22.86 27.58,22.99 | 27.95,22.21 27.17,22.59 | v27.3,22.86 27.17,22.59
N$15  (via drill 0.61)
  Top 0.406: 35.72,15.61 35.72,16.35 v35.88,16.51 | 35.72,15.61 35.72,13.81 34.92,13.02 U9.4 | 40.92,14.45 42.7,14.45 42.7,15.88 R72.1 R70.2 | 40.92,14.45 v40.01,14.45 | 35.72,15.61 36.14,16.36 v35.88,16.51 | 35.72,15.61 35.58,16.46 v35.88,16.51 | 40.92,14.45 40.11,14.73 | v40.01,14.45 40.11,14.73 | 40.92,14.45 40.11,14.16 | v40.01,14.45 40.11,14.16 | 40.92,14.45 40.11,14.73 | 40.11,14.73 | v40.01,14.45 40.11,14.73 | 40.92,14.45 40.11,14.16 | v40.01,14.45 40.11,14.16 | 40.92,14.45 40.11,14.73 | v40.01,14.45 40.11,14.73 | 40.92,14.45 40.11,14.16 | v40.01,14.45 40.11,14.16
  Bottom 0.406: 36.79,16.51 37.94,16.51 39.36,15.09 | 36.79,16.51 v35.88,16.51 | v40.01,14.45 39.36,15.09 | 36.79,16.51 35.98,16.8 | v35.88,16.51 35.98,16.8 | 36.79,16.51 35.98,16.22 | v35.88,16.51 35.98,16.22 | 36.79,16.51 35.98,16.8 | 35.98,16.8 | v35.88,16.51 35.98,16.8 | 36.79,16.51 35.98,16.22 | v35.88,16.51 35.98,16.22 | 36.79,16.51 35.98,16.8 | v35.88,16.51 35.98,16.8 | 36.79,16.51 35.98,16.22 | v35.88,16.51 35.98,16.22 | 39.36,15.09 | 39.36,15.09 39.73,14.31 | v40.01,14.45 39.73,14.31 | 39.36,15.09 | 39.36,15.09 40.14,14.72 | v40.01,14.45 40.14,14.72 | 39.36,15.09 39.73,14.31 | 39.36,15.09 | 39.36,15.09 39.73,14.31 | v40.01,14.45 39.73,14.31 | 39.36,15.09 40.14,14.72 | v40.01,14.45 40.14,14.72
N$16
  Top 0.406: U9.1 37.47,11.27 36.35,11.27 36.35,15.08 R67.1 37.31,15.88 R72.2
N$17
  Top 0.406: C32.2 R62.2 29.53,9.05 R60.1 | R64.2 34.61,5.4 33.66,4.45 29.84,4.45 29.21,5.08 29.21,5.39 C32.2 | 29.53,5.56 C32.2
N$21
  Top 0.406: 38.18,26.43 39.37,27.62 R55.2 | 38.18,26.43 R51.1 | R52.2 35.56,30 38.1,30 38.1,26.51 38.18,26.43
N$22
  Top 0.406: R50.1 34.29,37.78 34.29,42.39 35.24,43.34 35.56,43.34 R49.2 35.72,43.5 36.83,42.39 36.83,41.75 39.37,41.75 R54.2
N$23
  Top 0.406: R48.1 34.29,50.48 34.29,54.45 35.24,55.4 35.56,55.4 R47.2 35.72,55.56 36.83,54.45 36.83,53.82 39.37,53.82 R53.2
PWM1H1  (via drill 0.61)
  Top 0.406: 15.66,49.21 16.67,49.21 16.67,49.53 U7.2 | 15.66,49.21 14.76,49.21 | 14.76,49.21 13.86,49.21 | 13.86,49.21 R56.2 | v14.76,49.37 14.76,49.21 | 15.66,49.21 14.91,49.64 v14.76,49.37 | 15.66,49.21 14.81,49.07 v14.76,49.37 | 13.86,49.21 14.71,49.07 v14.76,49.37 | 13.86,49.21 14.61,49.64 v14.76,49.37
  Bottom 0.406: SV2.2 14.76,46.51 14.76,48.46 | v14.76,49.37 14.76,48.46 | 14.76,48.46 15.05,49.27 | 15.05,49.27 | v14.76,49.37 15.05,49.27 | 14.76,48.46 14.48,49.27 | v14.76,49.37 14.48,49.27 | 14.76,48.46 15.05,49.27 | v14.76,49.37 15.05,49.27 | 14.76,48.46 14.48,49.27 | v14.76,49.37 14.48,49.27
PWM1H2
  Top 0.406: U8.2 16.67,36.83 16.67,36.51 R59.2 11.27,36.51 9.84,36.51 SV2.4
PWM1H3
  Top 0.406: U10.2 16.67,24.13 16.67,23.81 R71.2 11.27,23.81 7.94,23.81 SV2.6
PWM1L1  (via drill 0.61)
  Top 0.406: 11.43,55.4 R57.2 11.12,55.24 | v13.81,46.99 14.73,46.99 | 14.73,46.99 U7.4 | 14.73,46.99 13.91,47.28 | v13.81,46.99 13.91,47.28 | 14.73,46.99 13.91,46.7 | v13.81,46.99 13.91,46.7 | 14.73,46.99 13.91,47.28 | 13.91,47.28 | v13.81,46.99 13.91,47.28 | 14.73,46.99 13.91,46.7 | v13.81,46.99 13.91,46.7 | 14.73,46.99 13.91,47.28 | v13.81,46.99 13.91,47.28 | 14.73,46.99 13.91,46.7 | v13.81,46.99 13.91,46.7
  Top 0.508: SV2.1 5.08,52.19 8.45,55.56 R57.2
  Bottom 0.406: SV2.1 6.19,39.37 13.16,46.34 | 13.16,46.34 v13.81,46.99 | 13.16,46.34 | 13.16,46.34 13.94,46.72 | v13.81,46.99 13.94,46.72 | 13.16,46.34 | 13.16,46.34 13.54,47.12 | v13.81,46.99 13.54,47.12 | 13.16,46.34 13.94,46.72 | 13.16,46.34 13.54,47.12 | 13.16,46.34 13.94,46.72 | v13.81,46.99 13.94,46.72 | 13.16,46.34 13.54,47.12 | v13.81,46.99 13.54,47.12
PWM1L2  (via drill 0.61)
  Top 0.406: 11.43,42.7 R63.2 11.12,42.55 10.16,42.55 7.62,40.01 7.62,36.2 5.71,34.29 SV2.3 | U8.4 15.56,34.29 14.93,33.67 | 14.93,33.67 v14.29,33.02 | 14.93,33.67 14.16,33.3 v14.29,33.02 | 14.93,33.67 14.56,32.89 v14.29,33.02
  Bottom 0.406: SV2.3 6.35,33.02 13.37,33.02 | 13.37,33.02 v14.29,33.02 | 13.37,33.02 14.19,32.73 v14.29,33.02 | 13.37,33.02 14.19,33.31 v14.29,33.02
PWM1L3
  Top 0.406: 11.43,30 R73.2 | U10.4 18.26,21.59 18.26,25.72 13.97,30 11.59,30 R73.2 | R73.2 6.03,30.16 SV2.5

### Text on the board
tPlace: GND | 3V3 | L1 | M3_ADC | M2_ADC | H1 | M1_ADC | L2 | MOTORCUR | H2 | L3 | H3 | - | +